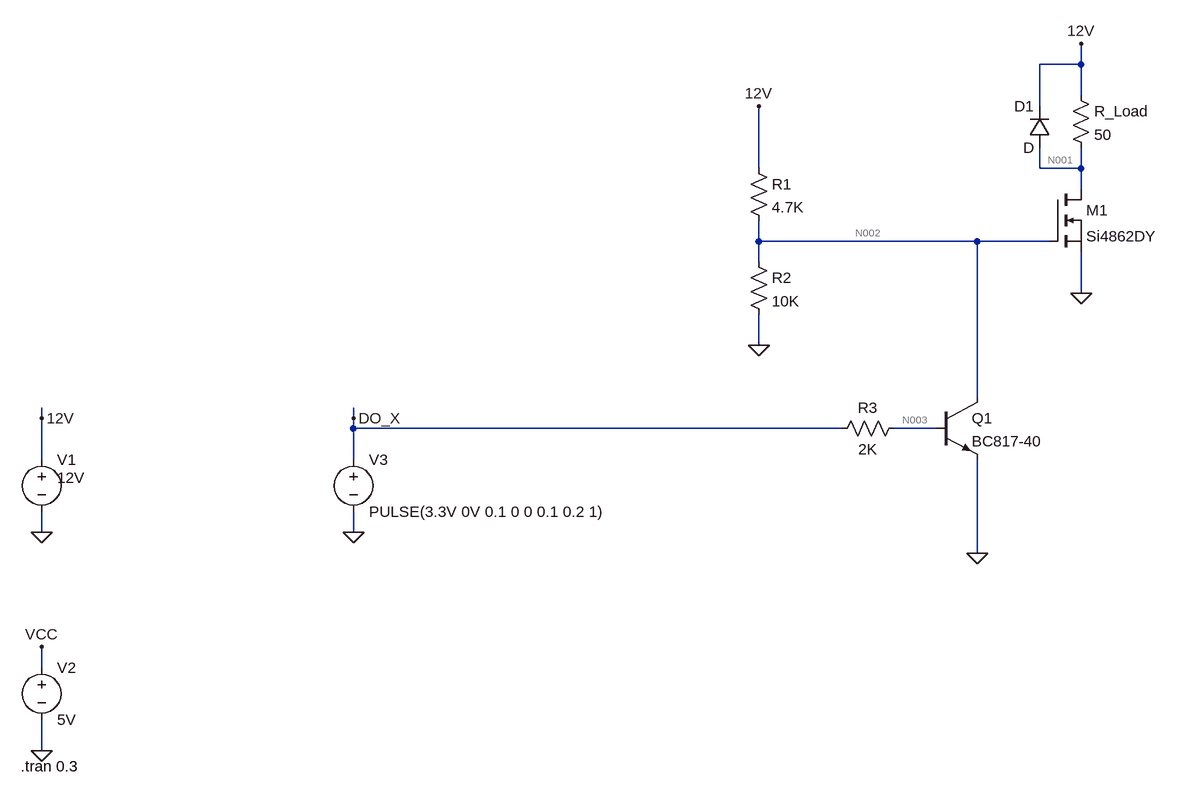
[diagram p0: schematic Fan.asc]
Fan.asc, the LTspice schematic file:
Version 4
SHEET 1 1984 864
WIRE 1552 -656 1552 -688
WIRE 1552 -656 1488 -656
WIRE 1552 -608 1552 -656
WIRE 1488 -592 1488 -656
WIRE 1056 -496 1056 -592
WIRE 1488 -496 1488 -528
WIRE 1552 -496 1552 -528
WIRE 1552 -496 1488 -496
WIRE 1552 -464 1552 -496
WIRE 1056 -384 1056 -416
WIRE 1392 -384 1056 -384
WIRE 1504 -384 1392 -384
WIRE 1056 -352 1056 -384
WIRE 1552 -304 1552 -368
WIRE 1056 -224 1056 -272
WIRE 1392 -144 1392 -384
WIRE -48 -112 -48 -128
WIRE 432 -112 432 -128
WIRE 432 -96 432 -112
WIRE 1184 -96 432 -96
WIRE 1328 -96 1264 -96
WIRE -48 -48 -48 -112
WIRE 432 -48 432 -96
WIRE -48 64 -48 32
WIRE 432 64 432 32
WIRE 1392 96 1392 -48
WIRE -48 272 -48 240
WIRE -48 400 -48 352
FLAG -48 240 VCC
FLAG -48 400 0
FLAG -48 64 0
FLAG -48 -112 12V
FLAG 432 64 0
FLAG 432 -112 DO_X
FLAG 1056 -224 0
FLAG 1392 96 0
FLAG 1552 -304 0
FLAG 1552 -688 12V
FLAG 1056 -592 12V
SYMBOL voltage -48 256 R0
WINDOW 123 0 0 Left 0
WINDOW 39 0 0 Left 0
SYMATTR InstName V2
SYMATTR Value 5V
SYMBOL voltage -48 -64 R0
WINDOW 3 24 44 Left 2
WINDOW 123 0 0 Left 0
WINDOW 39 0 0 Left 0
SYMATTR Value 12V
SYMATTR InstName V1
SYMBOL voltage 432 -64 R0
WINDOW 123 0 0 Left 0
WINDOW 39 0 0 Left 0
SYMATTR InstName V3
SYMATTR Value PULSE(3.3V 0V 0.1 0 0 0.1 0.2 1)
SYMBOL res 1040 -512 R0
SYMATTR InstName R1
SYMATTR Value 4.7K
SYMBOL res 1040 -368 R0
SYMATTR InstName R2
SYMATTR Value 10K
SYMBOL npn 1328 -144 R0
SYMATTR InstName Q1
SYMATTR Value BC817-40
SYMBOL res 1280 -112 R90
WINDOW 0 0 56 VBottom 2
WINDOW 3 32 56 VTop 2
SYMATTR InstName R3
SYMATTR Value 2K
SYMBOL nmos 1504 -464 R0
SYMATTR InstName M1
SYMATTR Value Si4862DY
SYMBOL res 1536 -624 R0
SYMATTR InstName R_Load
SYMATTR Value 50
SYMBOL diode 1504 -528 R180
WINDOW 0 24 64 Left 2
WINDOW 3 24 0 Left 2
SYMATTR InstName D1
TEXT -80 424 Left 2 !.tran 0.3

The netlist it stands for:
* Fan.asc
V2 VCC 0 5V
V1 12V 0 12V
V3 DO_X 0 PULSE(3.3V 0V 0.1 0 0 0.1 0.2 1)
R1 12V N002 4.7K
R2 N002 0 10K
Q1 N002 N003 0 0 BC817-40
R3 N003 DO_X 2K
M1 N001 N002 0 0 Si4862DY
R_Load 12V N001 50
D1 N001 12V D
.model D D
.lib standard.dio
.model NPN NPN
.model PNP PNP
.lib standard.bjt
.model NMOS NMOS
.model PMOS PMOS
.lib standard.mos
.tran 0.3
.backanno
.end

* Results of the author's LTspice run, read from the files saved beside the schematic
* Operating Point, zero values left out:
*   V(vcc) = 5 V
*   V(12v) = 12 V
*   V(do_x) = 3.3 V
*   V(n002) = 6.797 mV
*   V(n003) = 693.1 mV
*   V(n001) = 12 V
*   Ic(Q1) = 2.551 mA
*   Ib(Q1) = 1.303 mA
*   Ie(Q1) = -3.855 mA
*   Id(M1) = 105.5 pA
*   Is(M1) = -105.5 pA
*   I(R1) = 2.552 mA
*   I(R2) = 679.7 nA
*   I(R3) = -1.303 mA
*   I(R_load) = 120.1 pA
*   I(V1) = -2.552 mA
*   I(V3) = -1.303 mA
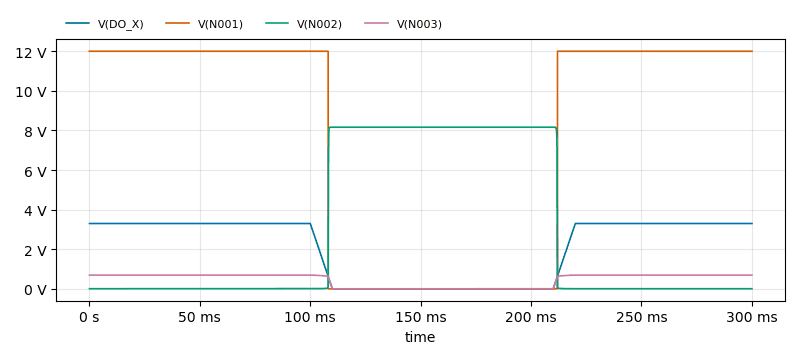
[diagram p1: Transient Analysis of Fan.asc, plotted from the saved traces]
* Transient Analysis, 1 run:
*   V(DO_X): min 0 V, max 3.3 V, average 2.09 V, rms 2.603 V, last 3.3 V
*   V(N001): min 930 µV, max 12 V, average 7.847 V, rms 9.704 V, last 12 V
*   V(N002): min 6.781 mV, max 8.163 V, average 2.826 V, rms 4.796 V, last 6.797 mV
*   V(N003): min 0 V, max 693.1 mV, average 456.1 mV, rms 560.6 mV, last 693.1 mV